# EAGLE design FiberLink (EAGLE 6.4)
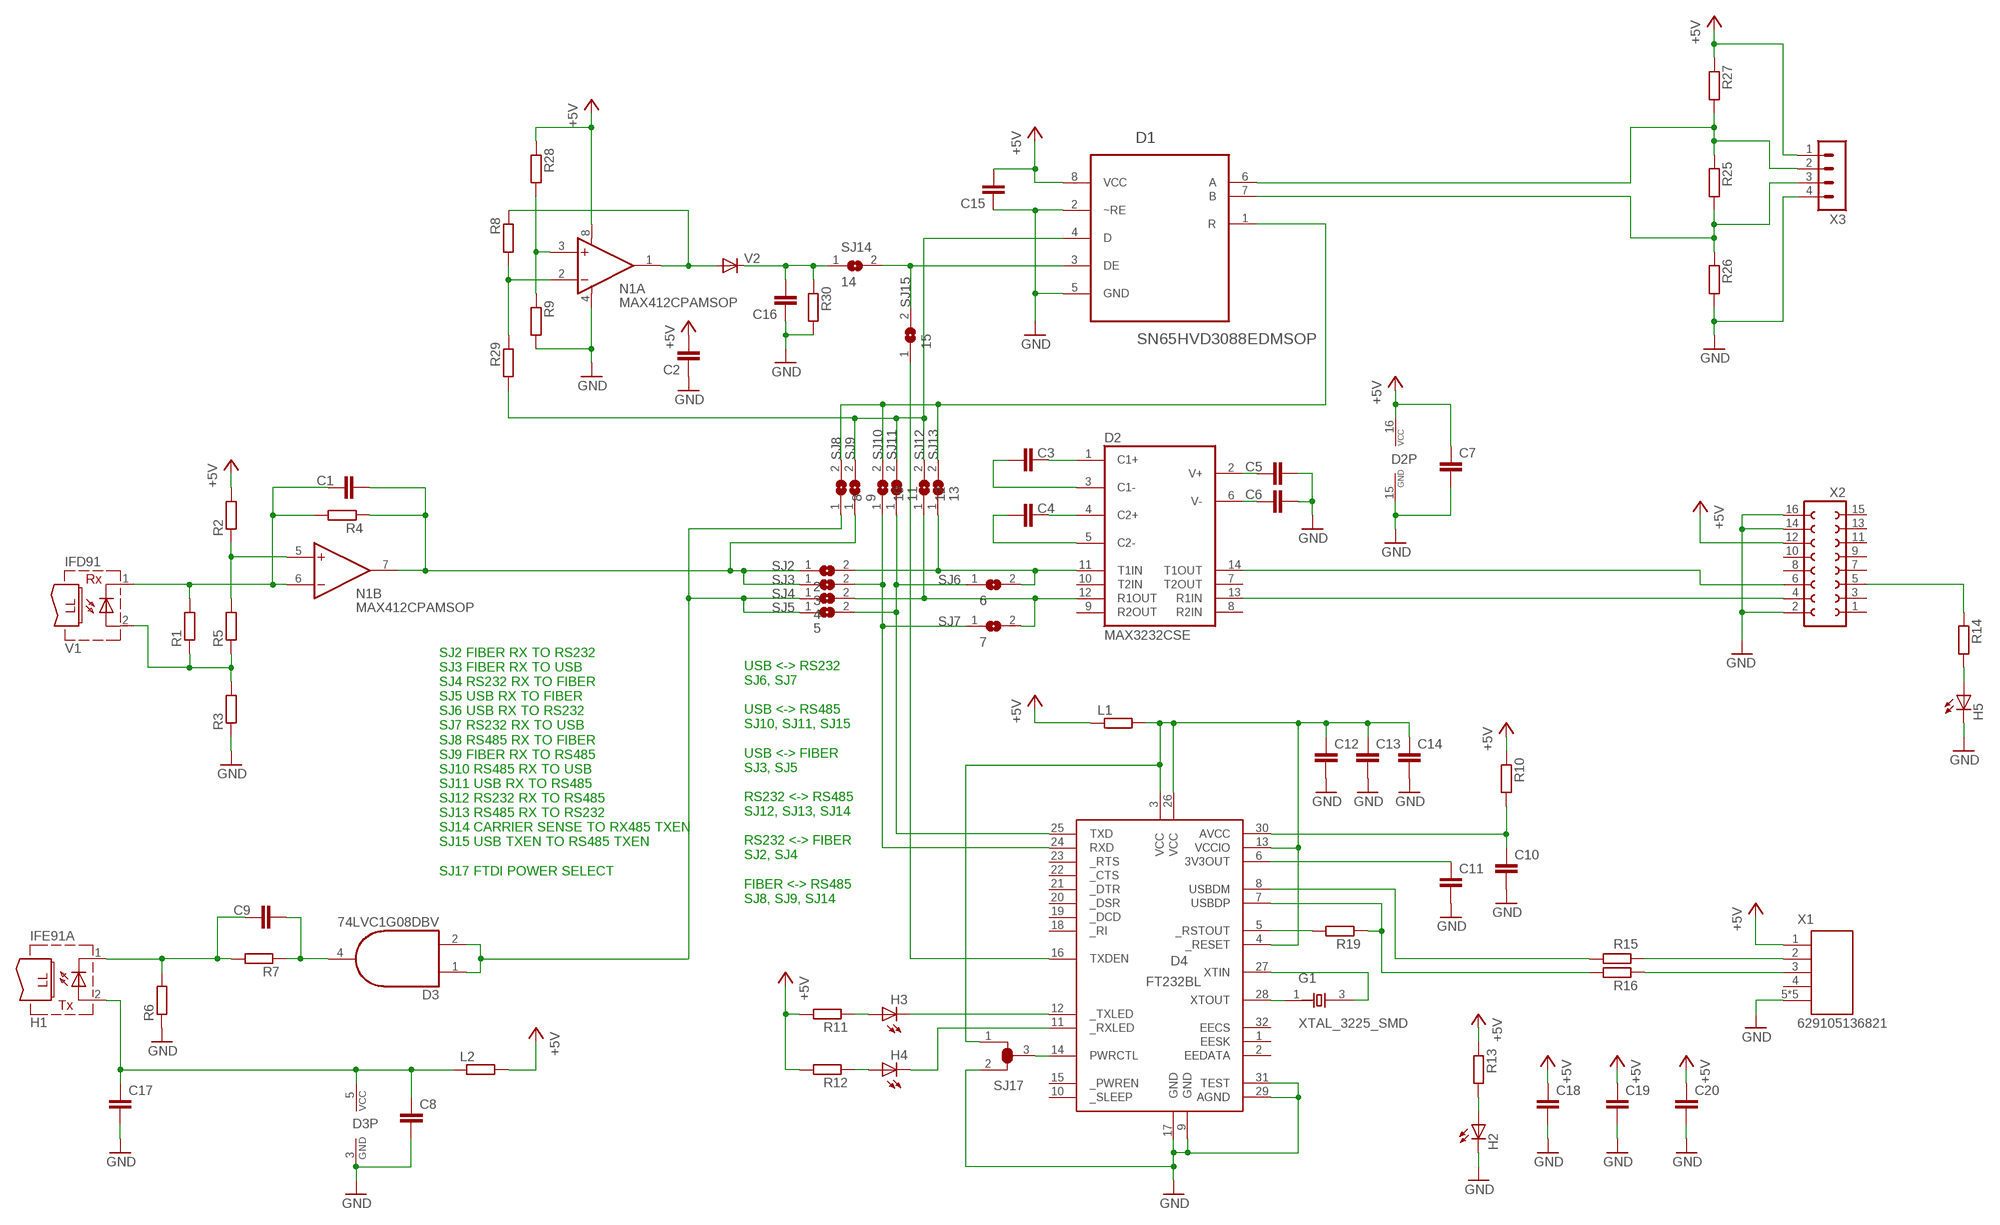
[diagram p0: schematic, sheet 1]

## Parts
C1  C-EUC0402  [C0402]
C2  C-EUC0402  [C0402]
C3  C-EUC0402  [C0402]
C4  C-EUC0402  [C0402]
C5  C-EUC0402  [C0402]
C6  C-EUC0402  [C0402]
C7  C-EUC0402  [C0402]
C8  C-EUC0402  [C0402]
C9  C-EUC0402  [C0402]
C10  C-EUC0402  [C0402]
C11  C-EUC0402  [C0402]
C12  C-EUC0402  [C0402]
C13  C-EUC0402  [C0402]
C14  C-EUC0402  [C0402]
C15  C-EUC0402  [C0402]
C16  C-EUC0402  [C0402]
C17  C-EUC0402  [C0402]
C18  C-EUC0805  [C0805]
C19  C-EUC0805  [C0805]
C20  C-EUC0805  [C0805]
D1  SN65HVD3088EDMSOP  [SOP65P490X110-8N]
D2  MAX3232CSE  [SO16]
D3  74LVC1G08DBV  [SOT23-5]
D4  FT232BL  [LQFP32]
G1  XTAL_3225_SMD  [X_3225]
H1  IFE91A  [IFO-IFX]
H2  LEDCHIP-LED0603  [CHIP-LED0603]
H3  LEDCHIP-LED0603  [CHIP-LED0603]
H4  LEDCHIP-LED0603  [CHIP-LED0603]
H5  LEDCHIP-LED0603  [CHIP-LED0603]
L1  R-EU_R0402  [R0402_VISHAY]
L2  R-EU_R0402  [R0402_VISHAY]
N1  MAX412CPAMSOP  [SOP65P490X110-8N]
R1  R-EU_R0402  [R0402_VISHAY]
R2  R-EU_R0402  [R0402_VISHAY]
R3  R-EU_R0402  [R0402_VISHAY]
R4  R-EU_R0402  [R0402_VISHAY]
R5  R-EU_R0402  [R0402_VISHAY]
R6  R-EU_R1206  [R1206]
R7  R-EU_R1206  [R1206]
R8  R-EU_R0402  [R0402_VISHAY]
R9  R-EU_R0402  [R0402_VISHAY]
R10  R-EU_R0402  [R0402_VISHAY]
R11  R-EU_R0402  [R0402_VISHAY]
R12  R-EU_R0402  [R0402_VISHAY]
R13  R-EU_R0402  [R0402_VISHAY]
R14  R-EU_R0402  [R0402_VISHAY]
R15  R-EU_R0402  [R0402_VISHAY]
R16  R-EU_R0402  [R0402_VISHAY]
R19  R-EU_R0402  [R0402_VISHAY]
R25  R-EU_R1206  [R1206]
R26  R-EU_R0603  [R0603]
R27  R-EU_R0603  [R0603]
R28  R-EU_R0402  [R0402_VISHAY]
R29  R-EU_R0402  [R0402_VISHAY]
R30  R-EU_R0402  [R0402_VISHAY]
SJ2  2  SJ  [SJ-SMALL]
SJ3  3  SJ  [SJ-SMALL]
SJ4  4  SJ  [SJ-SMALL]
SJ5  5  SJ  [SJ-SMALL]
SJ6  6  SJ  [SJ-SMALL]
SJ7  7  SJ  [SJ-SMALL]
SJ8  8  SJ  [SJ-SMALL]
SJ9  9  SJ  [SJ-SMALL]
SJ10  10  SJ  [SJ-SMALL]
SJ11  11  SJ  [SJ-SMALL]
SJ12  12  SJ  [SJ-SMALL]
SJ13  13  SJ  [SJ-SMALL]
SJ14  14  SJ  [SJ-SMALL]
SJ15  15  SJ  [SJ-SMALL]
SJ17  17  SJ-TRI  [SJ-SMALL-TRI]
V1  IFD91  [IFO-IFX]
V2  DIODE-SOD323-R  [SOD323-R]
X1  629105136821  [629105136821]
X2  FE08-2  [FE08-2]
X3  MA04-1  [MA04-1]

## Nets
485_HIGH: D1.6(A) R25.1 R27.2 X3.2
485_LOW: D1.7(B) R25.2 R26.1 X3.3
+5V: C2.2 C7.1 C15.2 C18.1 C19.1 C20.1 D1.8(VCC) D2.16(VCC) L1.1 L2.2 N1.8(A:V+) R2.2 R10.1 R11.2 R12.2 R13.1 R27.1 R28.1 X1.1 X2.12 X3.1
AVCC: C10.1 D4.30(AVCC) R10.2
CARRIER_SENSE: C16.2 R30.1 SJ14.1 V2.C
FPGADONE: R14.1 X2.5
G1: D4.27(XTIN) G1.3(X2)
GND: C2.1 C5.2 C6.2 C7.2 C8.2 C10.2 C11.2 C12.2 C13.2 C14.2 C15.1 C16.1 C17.2 C18.2 C19.2 C20.2 D1.2(~RE) D1.5(GND) D2.15(GND) D3.3(GND) D4.9(GND) D4.17(GND) D4.29(AGND) D4.31(TEST) H2.C H5.C N1.4(A:V-) R3.1 R6.1 R9.2 R26.2 R30.2 SJ17.2 X1.5 X1.Z1 X1.Z2 X1.Z3 X1.Z4 X2.2 X2.14 X2.16 X3.4
N$1: C1.1 N1.6(B:-IN) R1.2 R4.2 V1.1(C)
N$2: N1.1(A:OUT) R8.1 V2.A
N$3: R1.1 R3.2 R5.1 V1.2(A)
N$4: D4.12(_TXLED) H3.C
N$5: N1.5(B:+IN) R2.1 R5.2
N$6: C4.2 D2.5(C2-)
N$7: C4.1 D2.4(C2+)
N$8: C3.2 D2.3(C1-)
N$9: C3.1 D2.1(C1+)
N$10: C6.1 D2.6(V-)
N$11: C5.1 D2.2(V+)
N$12: D2.14(T1OUT) X2.6
N$13: D2.13(R1IN) X2.4
N$14: D4.11(_RXLED) H4.C
N$15: C9.1 H1.1(C) R6.2 R7.2
N$16: N1.3(A:+IN) R9.1 R28.2
N$17: C9.2 D3.4(O) R7.1
N$18: H3.A R11.1
N$19: R15.1 X1.2
N$20: H4.A R12.1
N$21: D4.8(USBDM) R15.2
N$22: H2.A R13.2
N$23: D4.7(USBDP) R16.2 R19.1
N$24: R16.1 X1.3
N$25: H5.A R14.2
N$26: D4.14(PWRCTL) SJ17.3
N$29: D4.5(_RSTOUT) R19.2
N$32: N1.2(A:-IN) R8.2 R29.1
N$33: D4.28(XTOUT) G1.1(X1)
RXD_232: D2.12(R1OUT) SJ4.2 SJ7.2 SJ12.1
RXD_485: D1.1(R) SJ8.2 SJ10.2 SJ13.2
RXD_FIBER: C1.2 N1.7(B:OUT) R4.1 SJ2.1 SJ3.1 SJ9.1
RXD_USB: D4.24(RXD) SJ3.2 SJ7.1 SJ10.1
TX_VCC: C8.1 C17.1 D3.5(VCC) H1.2(A) L2.1
TXD_232: D2.11(T1IN) SJ2.2 SJ6.2 SJ13.1
TXD_485: D1.4(D) R29.2 SJ9.2 SJ11.2 SJ12.2
TXD_FIBER: D3.1(I0) D3.2(I1) SJ4.1 SJ5.1 SJ8.1
TXD_USB: D4.25(TXD) SJ5.2 SJ6.1 SJ11.1
TXEN_485: D1.3(DE) SJ14.2 SJ15.2
TXEN_USB: D4.16(TXDEN) SJ15.1
USB3V3: C11.1 D4.6(3V3OUT)
USBVCC: C12.1 C13.1 C14.1 D4.3(VCC) D4.4(_RESET) D4.13(VCCIO) D4.26(VCC) L1.2 SJ17.1
Unconnected: D2.7(T2OUT) D2.8(R2IN) D2.9(R2OUT) D2.10(T2IN) D4.1(EESK) D4.2(EEDATA) D4.10(_SLEEP) D4.15(_PWREN) D4.18(_RI) D4.19(_DCD) D4.20(_DSR) D4.21(_DTR) D4.22(_CTS) D4.23(_RTS) D4.32(EECS) X1.4 X2.1 X2.3 X2.7 X2.8 X2.9 X2.10 X2.11 X2.13 X2.15

## Notes on the sheet
- SJ2 FIBER RX TO RS232
  SJ3 FIBER RX TO USB
  SJ4 RS232 RX TO FIBER
  SJ5 USB RX TO FIBER
  SJ6 USB RX TO RS232
  SJ7 RS232 RX TO USB
  SJ8 RS485 RX TO FIBER
  SJ9 FIBER RX TO RS485
  SJ10 RS485 RX TO USB
  SJ11 USB RX TO RS485
  SJ12 RS232 RX TO RS485
  SJ13 RS485 RX TO RS232
  SJ14 CARRIER SENSE TO RX485 TXEN
  SJ15 USB TXEN TO RS485 TXEN
  
  SJ17 FTDI POWER SELECT
- USB <-> RS232
  SJ6, SJ7
  
  USB <-> RS485
  SJ10, SJ11, SJ15
  
  USB <-> FIBER
  SJ3, SJ5
  
  RS232 <-> RS485
  SJ12, SJ13, SJ14
  
  RS232 <-> FIBER
  SJ2, SJ4
  
  FIBER <-> RS485
  SJ8, SJ9, SJ14

## Library data of the parts
C1-C20 = rcl:C-EU: CAPACITOR, European symbol
D1 = OMAT_IC:SN65HVD3088ED: Low-Power RS-485 Transceivers, Available in a Small MSOP-8 Package
D2 = maxim:MAX3232*: True RS-232 Transceivers 3.0V to 5.5V, Low-Power up to 1Mbps, Using Four 0.1µF External Capacitors Source: http://pdfserv.maxim-ic.com/en/ds/MAX3222-MAX3241.pdf; MPN: MAX3232CSE; OC_FARNELL: 9725490; OC_NEWARK: 90C2890
D3 = 74xx-little-us:74*1G08: 2-input AND gate
D4 = ftdichip-3:FT232BL: USB UART 2nd Generation USB UART (USB <-> Serial) Controller
G1 = OMAT_IC:XTAL_3225_SMD: CRYSTAL CLOCK OSCILLATORS 5.0 Vdc or 3.3 Vdc - LOW PROFILE ULTRA MINIATURE CERAMIC SURFACE MOUNT Source: http://www.abracon.com/Oscillators/asf1-L-L1.pdf
H1 = OMAT_IC:IFE91A
H2-H5 = OMAT_IC:LED: LED OSRAM: - CHIPLED LG R971, LG N971, LY N971, LG Q971, LY Q971, LO R971, LY R971 LH N974, LH R974 LS Q976, LO Q976, LY Q976 LO Q996 - Hyper CHIPLED LW Q18S LB Q993, LB Q99A, LB R99A - SideLED LS A670, LO A670, LY A670, LG A670, LP A670 LB A673, LV A673, LT A673, LW A673 LH A674 LY A675 LS A676, LA A676, LO A676, LY A676, LW A676 LS A679, LY A679, LG A679 - Hyper Micro SIDELED® LS Y876, LA Y876, LO Y876, LY Y876 LT Y87S - SmartLED LW L88C, LW L88S LB L89C, LB L89S, LG L890 LS L89K, LO L89K, LY L89K LS L896, LA L896, LO L896, LY L896 - TOPLED LS T670, LO T670, LY T670, LG T670, LP T670 LSG T670, LSP T670, LSY T670, LOP T670, LYG T670 LG T671, LOG T671, LSG T671 LB T673, LV T673, LT T673, LW T673 LH T674 LS T676, LA T676, LO T676, LY T676, LB T676, LH T676, LSB T676, LW T676 LB T67C, LV T67C, LT T67C, LS T67K, LO T67K, LY T67K, LW E67C LS E67B, LA E67B, LO E67B, LY E67B, LB E67C, LV E67C, LT E67C LW T67C LS T679, LY T679, LG T679 LS T770, LO T770, LY T770, LG T770, LP T770 LB T773, LV T773, LT T773, LW T773 LH T774 LS E675, LA E675, LY E675, LS T675 LS T776, LA T776, LO T776, LY T776, LB T776 LHGB T686 LT T68C, LB T68C - Hyper Mini TOPLED® LB M676 - Mini TOPLED Santana® LG M470 LS M47K, LO M47K, LY M47K Source: http://www.osram.convergy.de LUXEON: - LUMILED® LXK2-PW12-R00, LXK2-PW12-S00, LXK2-PW14-U00, LXK2-PW14-V00 LXK2-PM12-R00, LXK2-PM12-S00, LXK2-PM14-U00 LXK2-PE12-Q00, LXK2-PE12-R00, LXK2-PE12-S00, LXK2-PE14-T00, LXK2-PE14-U00 LXK2-PB12-K00, LXK2-PB12-L00, LXK2-PB12-M00, LXK2-PB14-N00, LXK2-PB14-P00, LXK2-PB14-Q00 LXK2-PR12-L00, LXK2-PR12-M00, LXK2-PR14-Q00, LXK2-PR14-R00 LXK2-PD12-Q00, LXK2-PD12-R00, LXK2-PD12-S00 LXK2-PH12-R00, LXK2-PH12-S00 LXK2-PL12-P00, LXK2-PL12-Q00, LXK2-PL12-R00 Source: www.luxeon.com KINGBRIGHT: KA-3528ASYC Source: www.kingbright.com
L1 L2 R1-R16 R19 R25-R30 = rcl:R-EU_: RESISTOR, European symbol
N1 = OMAT_IC:MAX412CPA: OP AMP
SJ2-SJ15 = OMAT_IC:SJ: SMD solder JUMPER
SJ17 = OMAT_IC:SJ-TRI
V1 = OMAT_IC:IFD91
V2 = diode:DIODE-: DIODE
X1 = OMAT_IC:629105136821: WR-COM SMT Horizontal 5 Contacts Micro USB Type B,5 pins
X2 = OMAT_IC:FE08-2: FEMALE HEADER; OC_FARNELL: unknown; OC_NEWARK: unknown
X3 = OMAT_IC:MA04-1: PIN HEADER; OC_FARNELL: unknown; OC_NEWARK: unknown

## Board
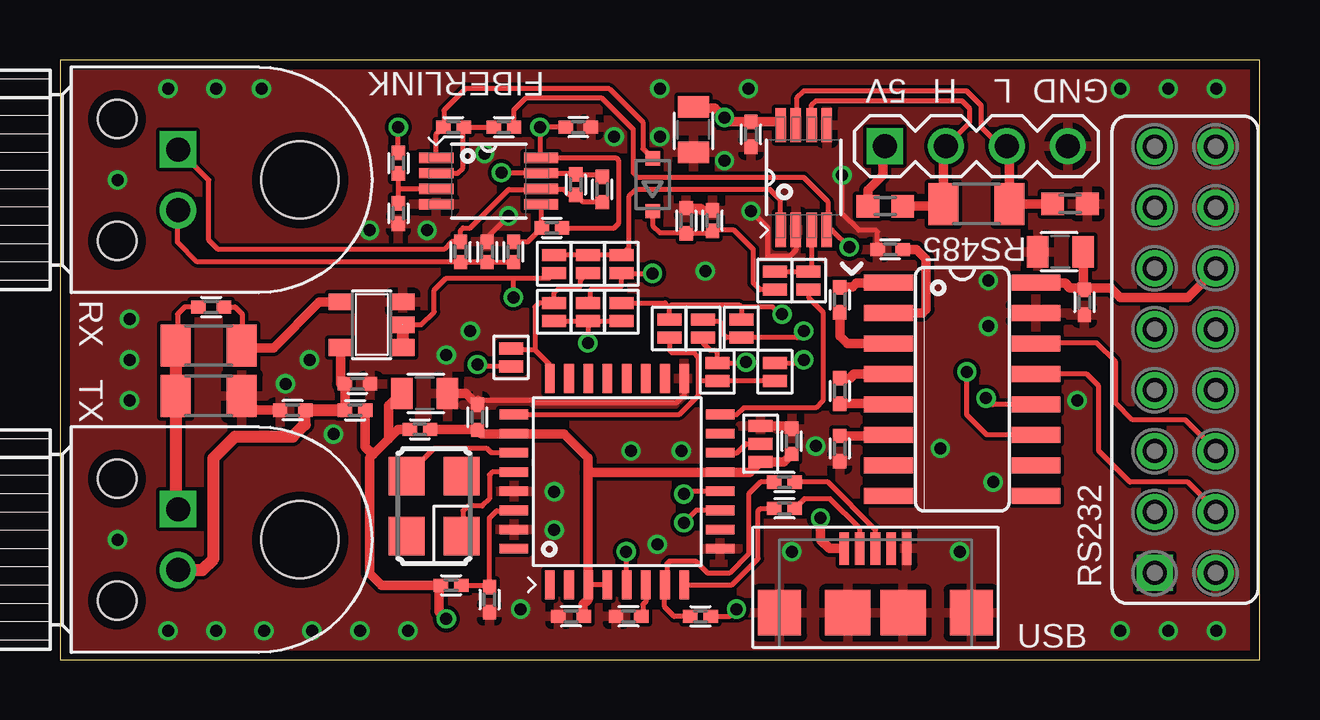
[diagram p1: board, top side]
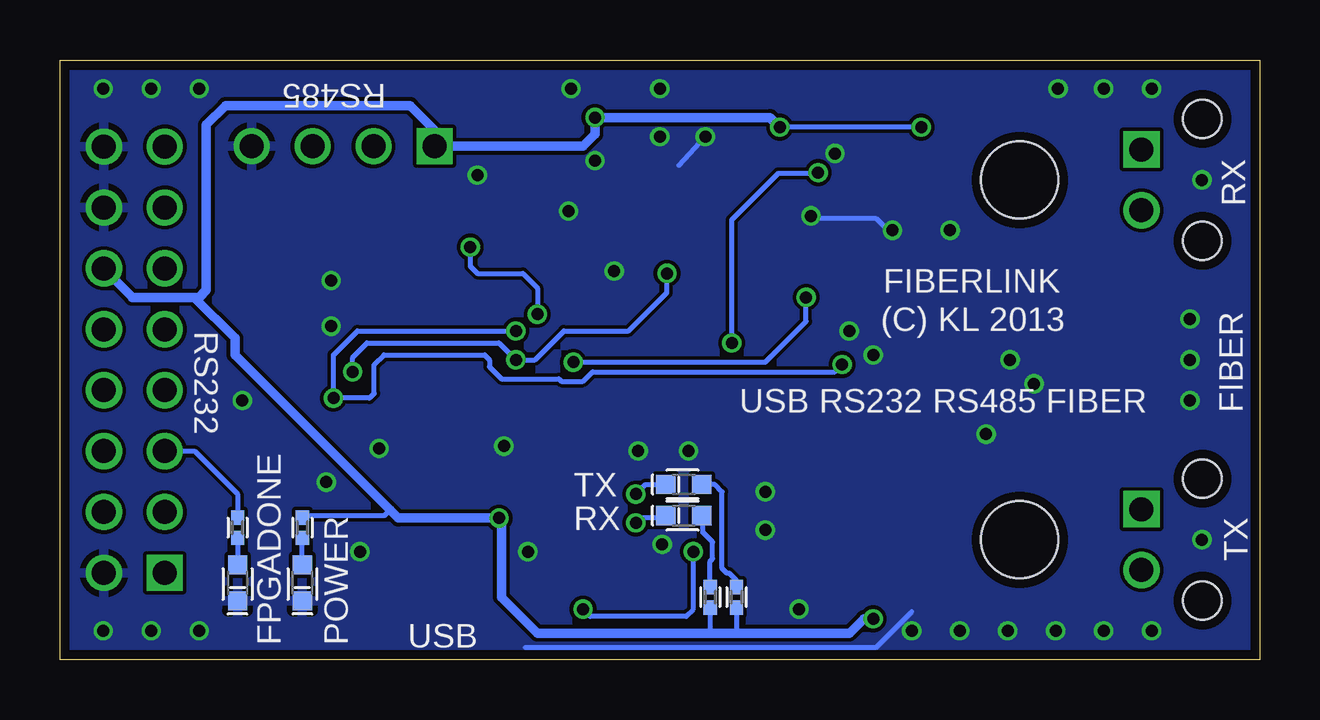
[diagram p2: board, bottom side, seen from below]

Size 50 x 25 mm. Coordinates in mm from the lower left corner, seen from the top.
Outline: 0,0 50,0 50,25 0,25 0,0
Copper layers (1*16): Top 0.035mm / dielectric 1.5mm / Bottom 0.035mm
Design rules "ITEADstudio_DRC *": minimum track width 6mil, minimum drill 12mil, track to track 6mil, track to pad 6mil, pad to pad 6mil, via to via 6mil, smd to smd 0mil, copper to edge 0.4mm, drill to drill 10mil, minimum pad ring 10mil, minimum via ring 6mil, stop-mask expansion 2mil, vias tented up to drill 100mil, thermal gap 10mil

### Footprints (pad centres in the part's own frame; a part is rotated, then mirrored left to right if it is on the bottom)
C0402 = smd 0.6 x 0.55: 1 -0.525,0; 2 0.525,0
C0805 = smd 0.9 x 1.3: 1 -0.95,0; 2 0.95,0
SOP65P490X110-8N = smd 1.422 x 0.432: 1 -2.184,0.965; 2 -2.184,0.33; 3 -2.184,-0.33; 4 -2.184,-0.965; 5 2.184,-0.965; 6 2.184,-0.33; 7 2.184,0.33; 8 2.184,0.965
SO16 = smd 0.66 x 2.032: 1 -4.445,-3.073; 2 -3.175,-3.073; 3 -1.905,-3.073; 4 -0.635,-3.073; 5 0.635,-3.073; 6 1.905,-3.073; 7 3.175,-3.073; 8 4.445,-3.073; 9 4.445,3.073; 10 3.175,3.073; 11 1.905,3.073; 12 0.635,3.073; 13 -0.635,3.073; 14 -1.905,3.073; 15 -3.175,3.073; 16 -4.445,3.073
SOT23-5 = smd 0.69 x 0.99: 1 -0.95,-1.29; 2 0,-1.29; 3 0.95,-1.29; 4 0.95,1.3; 5 -0.95,1.3
LQFP32 = smd 0.4 x 1.2: 1 -2.8,-4.3; 2 -2,-4.3; 3 -1.2,-4.3; 4 -0.4,-4.3; 5 0.4,-4.3; 6 1.2,-4.3; 7 2,-4.3; 8 2.8,-4.3; 17 2.8,4.3; 18 2,4.3; 19 1.2,4.3; 20 0.4,4.3; 21 -0.4,4.3; 22 -1.2,4.3; 23 -2,4.3; 24 -2.8,4.3 | smd 1.2 x 0.4: 9 4.3,-2.8; 10 4.3,-2; 11 4.3,-1.2; 12 4.3,-0.4; 13 4.3,0.4; 14 4.3,1.2; 15 4.3,2; 16 4.3,2.8; 25 -4.3,2.8; 26 -4.3,2; 27 -4.3,1.2; 28 -4.3,0.4; 29 -4.3,-0.4; 30 -4.3,-1.2; 31 -4.3,-2; 32 -4.3,-2.8
X_3225 = smd 1.6 x 1.5: 1 -1.25,-1.15; 2 1.25,-1.15; 3 1.25,1.15; 4 -1.25,1.15
IFO-IFX = drill 1 square: 1 -5.08,1.27 | drill 1: 2 -5.08,-1.27 | hole 3.2: 0,0 | hole 1.6: -7.62,2.54; -7.62,-2.54
CHIP-LED0603 = smd 0.8 x 0.8: A -0.75,0; C 0.75,0
R0402_VISHAY = smd 0.6 x 0.55: 1 -0.425,0; 2 0.425,0
R1206 = smd 1.25 x 1.75: 1 -1.375,0; 2 1.375,0
R0603 = smd 0.95 x 0.95: 1 -0.725,0; 2 0.725,0
SJ-SMALL = smd 0.5 x 1: 1 -0.375,0; 2 0.375,0
SJ-SMALL-TRI = smd 0.5 x 1: 1 -0.75,0; 2 0.75,0; 3 0,0
SOD323-R = smd 0.6 x 0.6: A 1.1,0; C -1.1,0
629105136821 = smd 0.4 x 1.35: 1 -1.3,0; 2 -0.65,0; 3 0,0; 4 0.65,0; 5 1.3,0 | smd 1.8 x 1.9: Z1 -4,-2.675; Z4 4,-2.675 | smd 1.9 x 1.9: Z2 -1.15,-2.675; Z3 1.15,-2.675
FE08-2 = drill 1 square: 1 -8.89,1.27 | drill 1: 2 -8.89,-1.27; 3 -6.35,1.27; 4 -6.35,-1.27; 5 -3.81,1.27; 6 -3.81,-1.27; 7 -1.27,1.27; 8 -1.27,-1.27; 9 1.27,1.27; 10 1.27,-1.27; 11 3.81,1.27; 12 3.81,-1.27; 13 6.35,1.27; 14 6.35,-1.27; 15 8.89,1.27; 16 8.89,-1.27
MA04-1 = drill 1 square: 1 -3.81,0 | drill 1: 2 -1.27,0; 3 1.27,0; 4 3.81,0

### Placement (x,y rotation side)
C1  22.6,19.6 90 top
C2  21.6,22.2 180 top
C3  32.5,15 270 top
C4  32.5,11.2 270 top
C5  34.6,17.1 180 top
C6  32.5,8.8 270 top
C7  42.7,14.9 270 top
C8  12.4,11.5 0 top
C9  6.3,14.7 0 top
C10  17.9,2.5 270 top
C11  23.7,1.8 180 top
C12  17.4,10.1 90 top
C13  21.3,1.8 180 top
C14  30.5,9.1 90 top
C15  28.8,21.9 90 top
C16  26.1,18.3 270 top
C17  9.7,10.4 180 top
C18  41.7,17 180 top
C19  15.2,11.1 0 top
C20  26.4,22.1 270 top
D1  31,20.1 90 top
D2  37.61,11.27 270 top
D3  12.99,13.96 90 top
D4  23.22,7.42 0 top
DRILEGEND  [DRILEGEND]  -9.63,-4.01 0 top  (outside the outline)
G1  15.59,6.4 90 top
H1  10,5 0 top
H2  39.9,3.2 270 bottom
H3  24,7.3 180 bottom
H4  24,6 180 bottom
H5  42.6,3.2 270 bottom
L1  15,9.6 0 top
L2  12.3,10.4 0 top
N1  17.87,19.95 0 top
R1  16.7,17 90 top
R2  20.5,18 0 top
R3  17.8,17 270 top
R4  21.5,19.8 270 top
R5  18.9,17 90 top
R6  6.2,11 180 top
R7  6.2,13.1 180 top
R8  16.4,22.2 0 top
R9  14.1,18.6 270 top
R10  16.3,3.1 0 top
R11  21.8,2.6 270 bottom
R12  22.9,2.6 270 bottom
R13  39.9,5.5 270 bottom
R14  42.6,5.5 270 bottom
R15  30.2,6.3 180 top
R16  30.2,7.4 180 top
R19  26.7,1.8 0 top
R25  38.2,19 0 top
R26  42.1,19 0 top
R27  34.4,18.9 0 top
R28  14.1,20.7 270 top
R29  18.5,22.2 0 top
R30  27.2,18.3 90 top
SJ2  [SJ-SMALL]  22,14.5 90 top
SJ3  [SJ-SMALL]  20.6,14.5 90 top
SJ4  [SJ-SMALL]  26.8,13.8 90 top
SJ5  [SJ-SMALL]  27.4,12 270 top
SJ6  [SJ-SMALL]  29.8,12 90 top
SJ7  [SJ-SMALL]  18.8,12.6 270 top
SJ8  [SJ-SMALL]  20.6,16.5 90 top
SJ9  [SJ-SMALL]  23.4,14.5 90 top
SJ10  [SJ-SMALL]  22,16.5 90 top
SJ11  [SJ-SMALL]  25.4,13.8 90 top
SJ12  [SJ-SMALL]  28.4,13.8 90 top
SJ13  [SJ-SMALL]  23.4,16.5 90 top
SJ14  [SJ-SMALL]  29.8,15.8 90 top
SJ15  [SJ-SMALL]  31.2,15.8 90 top
SJ17  SJ-TRI  [SJ-SMALL-TRI]  29.2,9 90 top
V1  10,20 0 top
V2  24.7,19.8 90 top
X1  33.99,4.63 0 top
X2  46.9,12.5 90 top
X3  38.2,21.4 0 top

### Tracks (layer width: path | path; a pad name or v marks a point on that pad's centre or on a via)
485_HIGH
  Top 0.2: D1.6 31.33,23.13 31.5,23.3 37.6,23.3 37.9,23 37.9,22.37 X3.2
  Top 0.4: X3.2 36.83,21.3 R25.1 36.73,18.9 R27.2
485_LOW
  Top 0.2: X3.3 39.2,21.4 38.4,22.2 38.4,23.1 37.8,23.7 31,23.7 30.7,23.4 30.7,22.32 D1.7
  Top 0.4: X3.3 39.58,21.3 R25.2 R26.1
+5V  (via drill 0.5)
  Top 0.2: 29.89,22.43 D1.8 | R28.1 v14.1,22.2 | C2.2 v20,22.2 20,20.97 N1.8 20.07,20.9 23.2,20.9 23.3,20.8 23.3,18.2 23.1,18 R2.2
  Top 0.4: R27.1 33.67,19.57 34.3,20.2 34.3,21.31 X3.1 | 29.89,22.43 C15.2 27.88,22.43 v27.7,22.6 27.3,23 26.45,23 C20.1 | X2.12 48.17,16.27 47,15.1 44.2,15.1 43.8,15.5 42.73,15.5 42.73,15.45 C7.1 | R10.1 15.8,3.1 | 15.8,3.1 13.4,3.1 12.9,3.6 12.9,8.4 13.05,8.55 | X1.1 32.07,4.63 31.7,5 v31.7,5.9 | 15.8,3.1 15.8,2 v16.1,1.7 | L2.2 12.72,8.88 13.05,8.55 | D2.16 40.7,15.7 41.9,15.7 42.1,15.5 42.62,15.5 C7.1 | C18.1 42.65,15.47 C7.1 | 13.05,8.55 13.7,9.2 | 13.7,9.2 14.1,9.6 L1.1 | C19.1 14.2,11.1 13.7,10.6 13.7,9.2
  Bottom 0.2: v14.1,22.2 v20,22.2 | R11.2 21.8,1.1 | R12.2 22.9,1.1 | 36.25,6.25 36.5,6 39.83,6 R13.1
  Bottom 0.4: X3.1 34.3,21.4 | 34.3,21.4 28.2,21.4 27.7,21.9 v27.7,22.6 20.4,22.6 v20,22.2 | 34.3,21.4 34.3,22 35.4,23.1 43.1,23.1 43.9,22.3 43.9,15.4 44.2,15.1 44.4,15.1 | 46.96,15.1 47,15.1 | 44.4,15.1 46.96,15.1 | 46.96,15.1 X2.12 | 44.4,15.1 42.7,13.4 42.7,12.7 36.25,6.25 35.9,5.9 v31.7,5.9 31.6,5.8 31.6,2.6 30.1,1.1 22.9,1.1 21.8,1.1 17.1,1.1 16.5,1.7 v16.1,1.7
AVCC
  Top 0.2: R10.2 17.82,3.1 C10.1 17.9,5.9 18.2,6.2 18.9,6.2 D4.30
CARRIER_SENSE
  Top 0.2: V2.C 24.7,18.1 25,17.8 26.07,17.8 C16.2 27.1,17.77 R30.1 27.23,17.9 28.1,17.9 28.9,17.1 28.9,15.7 29.18,15.43 SJ14.1
FPGADONE
  Bottom 0.2: X2.5 44.39,8.69 42.6,6.9 R14.1
G1
  Top 0.2: D4.27 17.98,8.62 17.8,8.8 15.59,8.8 G1.3
GND  (via drill 0.5)
  Top 0.2: D1.2 30.67,17.07 30.4,16.8 29.5,16.8 29.5,18 v28.8,18.7 | D4.17 26.02,11.02 25.7,10.7 19.8,10.7 19.7,10.8 17.43,10.8 | R3.1 17.8,17.6 v18.7,18.5 | C5.2 34.08,17.82 34,17.9 33.3,17.9 32.6,18.6 v32.6,20.2
  Top 0.4: C17.2 8.18,10.4 R6.1 | R30.2 26.77,18.73 26.7,18.8 26.12,18.8 C16.1 | C19.2 16.93,11.1 C12.2 17.4,10.78 17.43,10.8 | SJ17.2 30.38,9.75 C14.2
  Bottom 0.2: 18.7,18.4 16,18.4 15.5,17.9 | 24.2,20.6 v23.1,21.8 | 30.6,0.5 16,0.5 14.5,2
  other vias: 10.4,12.5 2.4,20 2.4,5 16.1,12.7 20.6,7 25.9,8.7 24.9,4.8 11.4,9.4 30.5,4.5 37.5,4.5 38.9,7.4 36.7,8.8 42.4,10.8 38.7,13.9 27.7,20.8 26.9,16.2 31.5,8.9 4.5,1.2 6.5,1.2 8.5,1.2 4.5,23.8 6.5,23.8 8.4,23.8 2.9,14.2 2.9,10.8 2.9,12.5 25,23.8 28.7,23.8 17.1,13.7 10.5,1.2 12.5,1.2 14.5,1.2 48.2,1.2 46.2,1.2 44.2,1.2 48.2,23.8 46.2,23.8 44.2,23.8 23.8,8.7 20.6,5.4 19.2,2.1 9.4,11.5 15.3,17.9 12.9,17.9 17.7,21.1 38.7,15.8 25,21.8
  pour Bottom: 0,0 50,0 50,25 0,25
  pour Top: 0,0 50,0 50,25 0,25
N$1
  Top 0.2: V1.1 6.2,19.99 6.2,17.5 6.6,17.1 16,17.1 16.32,17.43 R1.2 16.7,17.9 16.8,18 17.1,18 18.7,19.6 20.04,19.6 N1.6 20.07,19.6 21,19.6 21.23,19.38 R4.2 21.8,19.07 C1.1
N$2
  Top 0.2: N1.1 15.69,21.91 R8.1 16,22.23 16,22.9 16.9,23.8 22.9,23.8 24.3,22.4 24.3,21.3 V2.A
N$3
  Top 0.2: R3.2 R1.1 | R1.1 5.72,16.57 4.9,17.4 4.9,18.71 V1.2 | R1.1 R5.1
N$4  (via drill 0.5)
  Top 0.2: D4.12 26,7.02 v26,6.9
  Bottom 0.2: v26,6.9 25.6,7.3 H3.C
N$5
  Top 0.2: R5.2 19.5,17.43 R2.1 20.07,18.96 N1.5
N$6
  Top 0.4: C4.2 34.5,10.68 D2.5
N$7
  Top 0.4: C4.1 32.92,11.72 33.1,11.9 D2.4
N$8
  Top 0.4: D2.3 32.83,13.18 32.5,13.5 C3.2
N$9
  Top 0.4: C3.1 33.02,15.53 33.2,15.7 34.52,15.7 D2.1
N$10
  Top 0.4: C6.1 34.5,9.32 D2.6
N$11
  Top 0.4: D2.2 35.95,14.45 36.1,14.6 36.1,16.7 35.7,17.1 C5.1
N$12
  Top 0.2: X2.6 48.17,8.73 46.9,10 44.7,10 44,10.7 44,12.4 43.2,13.2 40.71,13.2 D2.14
N$13
  Top 0.2: X2.4 48.25,6.15 47,7.4 44.6,7.4 43.3,8.7 43.3,11.4 42.8,11.9 D2.13
N$14  (via drill 0.5)
  Top 0.2: D4.11 26.52,6.22 v26,5.7
  Bottom 0.2: v26,5.7 25.8,5.9 24.85,5.9 H4.C
N$15
  Top 0.2: C9.1 5.2,14.7 4.9,14.4 4.9,13.18 R7.2
  Top 0.5: R7.2 R6.2 4.83,6.37 H1.1
N$16
  Top 0.2: R28.2 14.1,19.7 | 14.1,19.7 R9.1 | N1.3 14.18,19.62 14.1,19.7
N$17
  Top 0.2: C9.2 7.3,14.7 7.6,14.4 7.6,13.12 R7.1
  Top 0.4: D3.4 10.81,14.91 8.9,13 7.67,13 R7.1
N$18
  Bottom 0.2: R11.1 21.8,3.3 22.1,3.6 22.2,3.6 22.4,3.8 22.4,7 22.7,7.3 H3.A
N$19
  Top 0.2: X1.2 33.34,5.46 32.1,6.7 31.02,6.7 R15.1
N$20
  Bottom 0.2: R12.1 22.9,4.1 22.8,4.2 22.8,4.9 23.2,5.3 23.2,5.95 H4.A
N$21
  Top 0.2: D4.8 28.02,3.12 29.1,4.2 29.1,6.2 29.2,6.3 R15.2
N$22
  Bottom 0.2: H2.A R13.2
N$23
  Top 0.2: R16.2 29.2,7.4 28.7,6.9 28.7,4.4 27.9,3.6 27,3.6 26.5,4.1 25.4,4.1 25.3,4 25.3,3.2 D4.7 25.2,3.1 25.2,2.2 25.6,1.8 R19.1
N$24
  Top 0.2: X1.3 33.99,5.41 32,7.4 R16.1
N$25
  Bottom 0.2: R14.2 H5.A
N$26
  Top 0.2: D4.14 28.22,8.62 28.6,9 SJ17.3
N$29  (via drill 0.5)
  Top 0.2: v23.6,4.5 23.6,3.14 D4.5 | R19.2 27.9,1.8 v28.2,2.1
  Bottom 0.2: v23.6,4.5 23.6,2.1 23.9,1.8 27.9,1.8 v28.2,2.1
N$32
  Top 0.2: R29.1 R8.2 16.8,22.18 16.8,20.5 16.58,20.28 N1.2
N$33
  Top 0.2: D4.28 18.02,7.82 17.9,7.7 17.9,6.7 17.6,6.4 17,6.4 16.8,6.2 16.8,5.21 G1.1
RXD_232  (via drill 0.5)
  Top 0.2: D2.12 38.87,10.63 v38.6,10.9 | v31,13.7 30.73,13.43 SJ12.1 27.77,13.43 27.6,13.6 27.6,14 27.5,14.1 26.88,14.1 SJ4.2 | SJ7.2 17.48,12.22 v17.4,12.3
  Bottom 0.2: v31,13.7 37.6,13.7 38.6,12.7 v38.6,10.9 37.1,10.9 36.9,11.1 36.9,12.3 36.5,12.7 32.3,12.7 32.1,12.5 32.1,12.2 31.6,11.7 29.2,11.7 29.1,11.6 28.2,11.6 27.8,12 17.7,12 v17.4,12.3
RXD_485
  Top 0.2: D1.1 30.04,19.16 29.6,19.6 24,19.6 23.7,19.3 23.7,17.18 SJ13.2 SJ10.2 SJ8.2
RXD_FIBER  (via drill 0.5)
  Top 0.2: C1.2 22.5,20.23 R4.1 21.45,20.28 N1.7 20.04,20.3 v18.4,20.3 | SJ3.1 SJ2.1 | SJ2.1 SJ9.1 | SJ2.1 v22,13.2
  Bottom 0.2: v22,13.2 22,18.34 N1.7 18.42,20.28 v18.4,20.3
RXD_USB
  Top 0.2: SJ10.1 21.7,15.82 21.7,15.6 21.6,15.5 20.8,15.5 20.6,15.3 SJ3.2 19.98,14.88 19.8,14.7 19.8,12.9 | D4.24 20.42,12.28 19.8,12.9 | 19.8,12.9 18.88,12.9 SJ7.1
TX_VCC
  Top 0.2: 11.69,11.48 11.86,11.48 C8.1
  Top 0.4: D3.5 11.69,11.48 | L2.1 C8.1
  Top 0.5: H1.2 5.93,3.73 6.4,4.2 6.4,8.4 7.3,9.3 9.7,9.3 10.2,9.8 10.2,10.38 C17.1 L2.1
TXD_232  (via drill 0.5)
  Top 0.2: D2.11 38.63,9.37 37.8,10.2 v37.8,12 | SJ6.2 30.88,12.38 v31,12.5 | SJ13.1 23.4,16.1 | SJ2.2 22.1,14.97 22.1,15.4 22.2,15.5 23.3,15.5 23.4,15.6 23.4,16.1 | 23.4,16.1 v24.7,16.1
  Bottom 0.2: v37.8,12 37.8,12.6 37.2,13.2 31.7,13.2 v31,12.5 30.2,12.5 29,13.7 26.3,13.7 24.7,15.3 v24.7,16.1
TXD_485  (via drill 0.5)
  Top 0.2: R29.2 18.93,22.93 19.4,23.4 22.6,23.4 23.9,22.1 23.9,20.3 24.1,20.1 31,20.1 32,19.1 32,17.95 D1.4 32.18,17.92 v32.9,17.2 | SJ11.2 25.4,14.7 | 25.4,14.7 25.5,14.8 28.3,14.8 28.4,14.7 | 28.4,14.7 SJ12.2 | SJ9.2 25.23,14.88 25.4,14.7 | v30.1,14.4 30,14.4 29.7,14.7 28.4,14.7
  Bottom 0.2: v32.9,17.2 32.9,16.4 32.6,16.1 30.7,16.1 30.1,15.5 v30.1,14.4
TXD_FIBER  (via drill 0.5)
  Top 0.2: v28.6,12.4 28.57,12.38 SJ5.1 27.4,12.8 27.3,12.9 27.1,12.9 26.8,13.2 SJ4.1 | D3.2 15.06,13.96 15.6,14.5 15.6,15.4 16.1,15.9 18.9,15.9 | v18.9,15.1 18.9,15.9 | 18.9,15.9 20.38,15.9 SJ8.1
  Top 0.5: D3.2 D3.1
  Bottom 0.2: v28.6,12.4 20.6,12.4 18.9,14.1 v18.9,15.1
TXD_USB
  Top 0.2: SJ11.1 25.4,12.9 25.5,12.8 26.4,12.8 26.6,12.6 26.6,11.6 | 26.6,11.6 26.6,11 25.82,10.22 D4.25 | SJ6.1 SJ5.2 26.62,11.62 26.6,11.6
TXEN_485
  Top 0.2: SJ14.2 SJ15.2 31.33,16.3 D1.3
TXEN_USB
  Top 0.2: SJ15.1 31.2,15.1 31.8,14.5 31.8,10.8 31.5,10.5 28.5,10.5 28.2,10.2 27.54,10.2 D4.16
USB3V3
  Top 0.2: D4.6 24.42,2.42 24.3,2.3 24.3,1.88 C11.1
USBVCC
  Top 0.2: 18.9,9.4 D4.26 | 27.54,7.8 D4.13 | D4.4 D4.3
  Top 0.4: 22,7.8 22,8.4 21,9.4 18.9,9.4 17.57,9.4 C12.1 17.38,9.6 L1.2 | 22,7.8 22,3.14 | 22,3.14 D4.3 | 22,7.8 27.54,7.8 28.75,7.8 SJ17.1 30.18,8.25 C14.1 | 22,3.14 22,2.5 21.8,2.3 21.8,1.82 C13.1

### Text on the board
tNames: FIBERLINK | 5V | H | L | GND | RS485 | RX | TX | RS232 | USB
bNames: RS485 | RX | FIBERLINK | (C) KL 2013 | FIBER | RS232 | USB RS232 RS485 FIBER | TX | RX | TX | POWER | FPGADONE | USB